# Altium project 609_key.PrjPcb
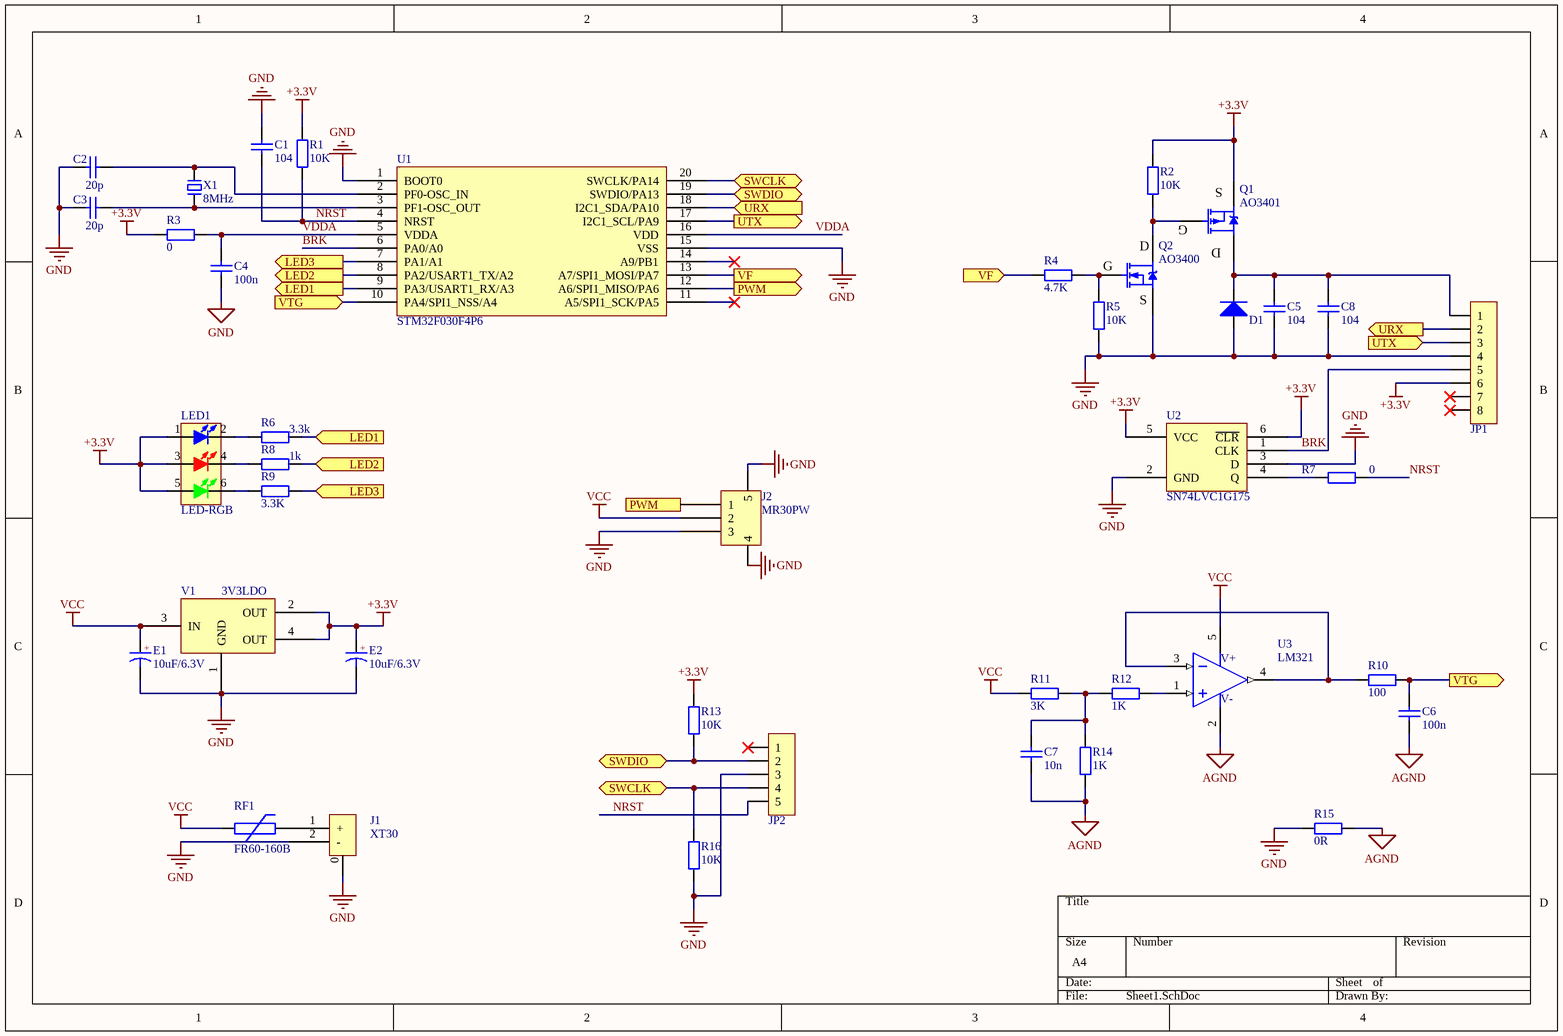
[diagram p0: Sheet1.SchDoc]
1 sheet, 40 parts. Net scope: flat (ports and power ports of the same name join across sheets).
Board files: PCB3.PcbDoc, 609_2.PcbDoc, 609_3.PcbDoc

## Sheet Sheet1.SchDoc
size A4; SheetNumber: 1; SheetTotal: 1

### Parts
C1  104  [C0603_L]
C2  20p  [C0603_L]
C3  20p  [C0603_L]
C4  100n  [C0603_L]
C5  104  [C0805_L]
C6  100n  [C0603_L]
C7  10n  [C0603_L]
C8  104  [C0805_L]
D1  TVS  [SOD-123]  (value not drawn)
E1  10uF/6.3V  [C_3216]
E2  10uF/6.3V  [C_3216]
J1  XT30  [XT30PW-F]
J2  MR30PW  [MR30PW-FB]
JP1  HDR-1X8  [MX1.25-WT-8P]  (value not drawn)
JP2  HDR-1X5  [XH2.54-LS-5P]  (value not drawn)
LED1  LED-RGB  [LED 5050]
Q1  AO3401  [SOT23-3M]
Q2  AO3400  [SOT23-3M]
R1  10K  [R0603_L]
R2  10K  [R0603_L]
R3  0  [R0603_L]
R4  4.7K  [R0603_L]
R5  10K  [R0603_L]
R6  3.3k  [R0603_L]
R7  0  [R0603_L]
R8  1k  [R0603_L]
R9  3.3K  [R0603_L]
R10  100  [R0603_L]
R11  3K  [R0603_L]
R12  1K  [R0603_L]
R13  10K  [R0603_L]
R14  1K  [R0603_L]
R15  0R  [R0603_L]
R16  10K  [R0603_L]
RF1  FR60-160B  [FU 0805]
U1  STM32F030F4P6  [TSSOP20_N]
U2  SN74LVC1G175  [SOT-23-6]
U3  LM321  [SOT23-5M]
V1  3V3LDO  [SOT223_M]
X1  8MHz  [HC-49S]

### Ports
LED1 (in), LED1 (out), LED2 (in), LED2 (out), LED3 (in), LED3 (out), PWM (in), PWM (out), SWCLK (bidir), SWDIO (bidir), URX (in), URX (out), UTX (in), UTX (out), VF (in), VF (out), VTG (in), VTG (out)

### Nets
+3.3V: E2.1(A) JP1.6 LED1.1(BULE_A) LED1.3(RED_A) LED1.5(GREEN_A) Q1.2(S) R1.2 R2.2 R3.1 R13.2 U2.5(VCC) U2.6(~{CLR}) V1.2(OUT) V1.4(OUT)
AGND: C6.1 C7.1 R14.1 R15.2 U3.2(V-)
GND: C1.2 C2.1 C3.1 C4.1 C5.1 C8.1 D1.1(A) E1.2(K) E2.2(K) J1.2(-) J2.3 J2.4 J2.5 JP1.4 JP2.3 Q2.2(S) R5.1 R15.1 R16.1 U1.1(BOOT0) U1.15(VSS) U2.2(GND) U2.3(D) V1.1(GND)
VCC: E1.1(A) J2.2 R11.1 RF1.1 U3.5(V+) V1.3(IN)
BRK: JP1.5 U1.6(PA0/A0) U2.1(CLK)
NRST: C1.1 JP2.5 R1.1 R7.2 U1.4(NRST)
VDDA: C4.2 R3.2 U1.5(VDDA) U1.16(VDD)
NetC2_2: C2.2 U1.2(PF0-OSC_IN) X1.2
NetC3_2: C3.2 U1.3(PF1-OSC_OUT) X1.1
NetC5_2: C5.2 C8.2 D1.2(K) JP1.1 Q1.3(D)
NetC6_2: C6.2 R10.2 U1.10(PA4/SPI1_NSS/A4) ; port VTG
NetC7_2: C7.2 R11.2 R12.1 R14.2
NetJ1_1: J1.1(+) RF1.2
NetJ2_1: J2.1 U1.12(A6/SPI1_MISO/PA6) ; port PWM
NetJP1_2: JP1.2 U1.18(I2C1_SDA/PA10) ; port URX
NetJP1_3: JP1.3 U1.17(I2C1_SCL/PA9) ; port UTX
NetJP2_2: JP2.2 R13.1 U1.19(SWDIO/PA13) ; port SWDIO
NetJP2_4: JP2.4 R16.2 U1.20(SWCLK/PA14) ; port SWCLK
NetLED1_2: LED1.2(BULE_K) R6.1
NetLED1_4: LED1.4(RED_K) R8.1
NetLED1_6: LED1.6(GREEN_K) R9.1
NetQ1_1: Q1.1(G) Q2.3(D) R2.1
NetQ2_1: Q2.1(G) R4.2 R5.2
NetR4_1: R4.1 U1.13(A7/SPI1_MOSI/PA7) ; port VF
NetR6_2: R6.2 U1.9(PA3/USART1_RX/A3) ; port LED1
NetR7_1: R7.1 U2.4(Q)
NetR8_2: R8.2 U1.8(PA2/USART1_TX/A2) ; port LED2
NetR9_2: R9.2 U1.7(PA1/A1) ; port LED3
NetR10_1: R10.1 U3.3(IN-) U3.4(OUT)
NetR12_2: R12.2 U3.1(IN+)

Not connected (* = marked no-connect by the designer): J1 0(GND); JP1 7* 8*; JP2 1*; U1 11(A5/SPI1_SCK/PA5)* 14(A9/PB1)*

### Notes on the sheet
- (in symbol CT) +

### Library data of the parts
C1-C8 = C: 贴片电容/MLCC电容; BOM名称: 无极性贴片电容; 联系下单店铺卖家 免费帮你查找封装: 联系下单店铺卖家 免费技术支持
D1 = TVS: TVS通用; 以赠品形式获赠本封装库的买家，还可联系卖家免费指导AD软件使用: 封装库来自淘宝卖家ID：黄晶宝石; Code_JEDEC: DO-214-AB
E1 E2 = CT: 贴片钽电容; 联系下单店铺卖家 免费帮你查找封装: 联系下单店铺卖家 免费技术支持; BOM名称: 贴片钽电容
JP1 = Header 8: 8P连接器; 联系卖家 免费技术支持: 封装库来自淘宝卖家ID：黄晶宝石; BOM名称: 8P连接器
JP2 = Header 5: 5P接插件; 联系卖家，免费查找封装: 唯一出售店铺网址https://shop463601444.taobao.com; 封装库来自淘宝卖家ID：黄晶宝石: 其他店铺购入均为盗版封装库，请立即申请退款，本店现金奖励50~200元; BOM名称: 5P接插件
LED1 = LED-RGB 5050: 5050三基色LED; BOM名称: 三基色LED; 封装库来自淘宝卖家：黄晶宝石: 其他店铺购入均为盗版封装库，请立即申请退款，本店现金奖励200~1000元
Q1 = AO3401: P沟道 30V/4.2A; BOM名称: 场效应管; 8元以下特价购入的买家: 还可以联系卖家远程指导AD软件使用; 参数: P沟道 30V/4.2A
Q2 = AO3400: N沟道 30V/4.2A; BOM名称: 场效应管; 8元以下特价购入的买家: 还可以联系卖家远程指导AD软件使用; 参数: N沟道 30V/4.2A
R1-R16 = R: 贴片电阻; 联系下单店铺卖家 免费帮你查找封装: 联系下单店铺卖家 免费技术支持; BOM名称: 贴片电阻
RF1 = FU-PPTC: PPTC自恢复保险丝; 联系卖家，免费查找封装: 唯一出售店铺网址https://shop463601444.taobao.com; 封装库来自淘宝卖家：黄晶宝石: 其他店铺购入均为盗版封装库，请立即申请退款，本店现金奖励200~1000元; BOM名称: PPTC自恢复保险丝
U1 = STM32F030F4: Flash: 16K/RAM: 4K/IO: 15; 联系卖家，免费查找封装: 唯一出售店铺网址https://shop463601444.taobao.com
U2 = SN74LVC1G175: 单路D触发器
U3 = LM321: Low Power Single Op Amp, 5-pin SOT-23; 联系下单店铺卖家 免费帮你查找封装: 唯一出售店铺网址https://shop463601444.taobao.com
V1 = CJT1117B-3.3: 低压差线性稳压芯片（4脚是out）
X1 = XTAL-2P: 2脚无源晶振(谐振器）; 联系下单店铺卖家 免费帮你查找封装: 联系下单店铺卖家 免费技术支持; BOM名称: 2脚无源晶振(谐振器）